# EAGLE schematic SparkFun_Tsunami_Qwiic (EAGLE 9.6.2)

## Sheet 1 of 2
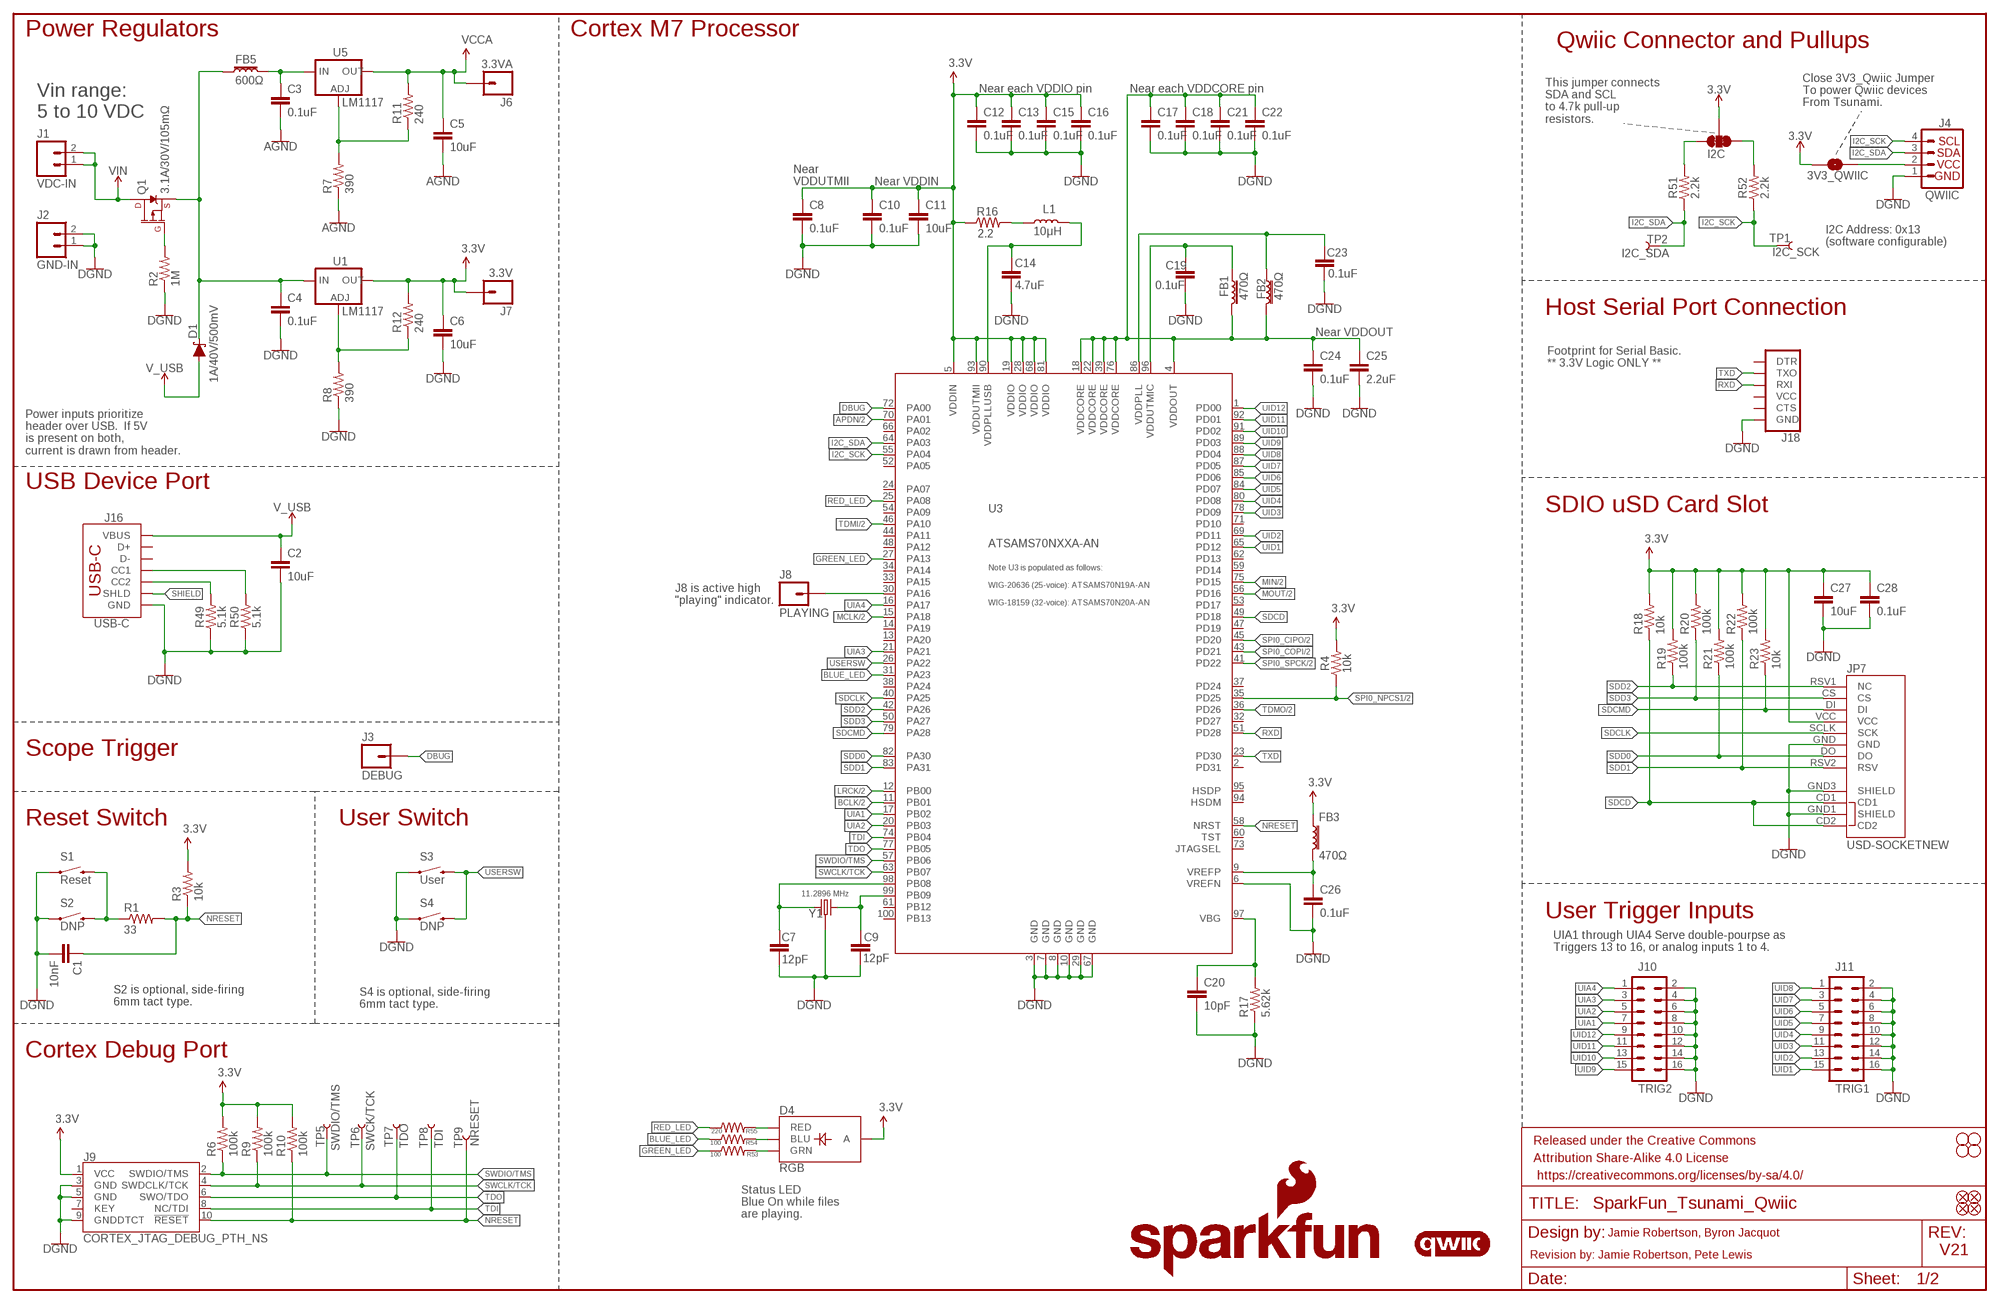
[diagram p0: schematic, sheet 1]

### Parts
3V3_QWIIC  JUMPER-SMT_2_NO_SILK  [SMT-JUMPER_2_NO_SILK]
C1  10nF  10NF-0402T-25V-10%  [0402-TIGHT]
C2  10uF  10UF-0402T-6.3V-20%  [0402-TIGHT]
C3  0.1uF  0.1UF-0402T-16V-10%  [0402-TIGHT]
C4  0.1uF  0.1UF-0402T-16V-10%  [0402-TIGHT]
C5  10uF  10UF-0402T-6.3V-20%  [0402-TIGHT]
C6  10uF  10UF-0402T-6.3V-20%  [0402-TIGHT]
C7  12pF  12PF-0402T-50V-5%  [0402-TIGHT]
C8  0.1uF  0.1UF-0402T-16V-10%  [0402-TIGHT]
C9  12pF  12PF-0402T-50V-5%  [0402-TIGHT]
C10  0.1uF  0.1UF-0402T-16V-10%  [0402-TIGHT]
C11  10uF  10UF-0402T-6.3V-20%  [0402-TIGHT]
C12  0.1uF  0.1UF-0402T-16V-10%  [0402-TIGHT]
C13  0.1uF  0.1UF-0402T-16V-10%  [0402-TIGHT]
C14  4.7uF  4.7UF-0402_TIGHT-6.3V-20%-X5R  [0402-TIGHT]
C15  0.1uF  0.1UF-0402T-16V-10%  [0402-TIGHT]
C16  0.1uF  0.1UF-0402T-16V-10%  [0402-TIGHT]
C17  0.1uF  0.1UF-0402T-16V-10%  [0402-TIGHT]
C18  0.1uF  0.1UF-0402T-16V-10%  [0402-TIGHT]
C19  0.1uF  0.1UF-0402T-16V-10%  [0402-TIGHT]
C20  10pF  10PF-0603-50V-5%  [0603]
C21  0.1uF  0.1UF-0402T-16V-10%  [0402-TIGHT]
C22  0.1uF  0.1UF-0402T-16V-10%  [0402-TIGHT]
C23  0.1uF  0.1UF-0402T-16V-10%  [0402-TIGHT]
C24  0.1uF  0.1UF-0402T-16V-10%  [0402-TIGHT]
C25  2.2uF  2.2UF-0603-10V-20%  [0603]
C26  0.1uF  0.1UF-0402T-16V-10%  [0402-TIGHT]
C27  10uF  10UF-0402T-6.3V-20%  [0402-TIGHT]
C28  0.1uF  0.1UF-0402T-16V-10%  [0402-TIGHT]
D1  1A/40V/500mV  DIODE-SCHOTTKY-SS14  [SMA-DIODE]
D4  RGB  LED-RGB-CAPLCC  [P-LCC-4-3]
FB1  470Ω  FERRITE_BEAD-0603-470Ω-100MHZ-1A-200MILIΩ  [0603]
FB2  470Ω  FERRITE_BEAD-0603-470Ω-100MHZ-1A-200MILIΩ  [0603]
FB3  470Ω  FERRITE_BEAD-0603-470Ω-100MHZ-1A-200MILIΩ  [0603]
FB5  600Ω  FERRITE_BEAD-0805-600Ω-100MHZ  [0805]
FD1  FIDUCIALUFIDUCIAL  [FIDUCIAL-MICRO]
FD2  FIDUCIALUFIDUCIAL  [FIDUCIAL-MICRO]
FD3  FIDUCIALUFIDUCIAL  [FIDUCIAL-MICRO]
FD4  FIDUCIALUFIDUCIAL  [FIDUCIAL-MICRO]
FRAME1  FRAME-LEDGER  [CREATIVE_COMMONS]
H1  STAND-OFF  [STAND-OFF]
H2  STAND-OFF  [STAND-OFF]
H3  STAND-OFF  [STAND-OFF]
H4  STAND-OFF  [STAND-OFF]
I2C  JUMPER-SMT_3_2-NC_TRACE_SILK  [SMT-JUMPER_3_2-NC_TRACE_SILK]
J1  VDC-IN  CONN_021X02_NO_SILK  [1X02_NO_SILK]
J2  GND-IN  CONN_021X02_NO_SILK  [1X02_NO_SILK]
J3  DEBUG  CONN_01PTH_NO_SILK_YES_STOP  [1X01_NO_SILK]
J4  QWIIC  I2C_STANDARDQWIIC  [JST04_1MM_RA]
J6  3.3VA  CONN_01PTH_NO_SILK_YES_STOP  [1X01_NO_SILK]
J7  3.3V  CONN_01PTH_NO_SILK_YES_STOP  [1X01_NO_SILK]
J8  PLAYING  CONN_01PTH_NO_SILK_YES_STOP  [1X01_NO_SILK]
J9  CORTEX_JTAG_DEBUG_PTH_NS  [2X5-PTH-1.27MM-NO_SILK]
J10  TRIG2  CONN_08X2_NOSILK  [2X8_NOSILK]
J11  TRIG1  CONN_08X2_NOSILK  [2X8_NOSILK]
J16  USB-C  USB_C_4-LAYER-ISOLATED  [USB-C-16P-4LAYER-ISOLATED]
J18  6_PIN_SERIAL_TARGETSILK  [6_PIN_SERIAL_TARGET_SIDE_W_SILK]
JP7  USD-SOCKETNEW  [MICRO-SD-SOCKET-PP]
L1  10μH  10μH_SHIELDED_INDUCTOR0805  [0805]
LOGO2  SFE_LOGO_NAME_FLAME.2_INCH  [SFE_LOGO_NAME_FLAME_.2]
LOGO3  QWIIC_LOGO_4MM  [QWIIC_4MM]
Q1  3.1A/30V/105mΩ  MOSFET_PCH-DMG2307L  [SOT23-3]
R1  33  33OHM-0603-1/10W-1%  [0603]
R2  1M  1MOHM-0603-1/4W-5%  [0603]
R3  10k  10KOHM-0402T-1/16W-1%  [0402-TIGHT]
R4  10k  10KOHM-0402T-1/16W-1%  [0402-TIGHT]
R6  100k  100KOHM-0402T-1/16W-1%  [0402-TIGHT]
R7  390  390OHM-0603-1/10W-1%  [0603]
R8  390  390OHM-0603-1/10W-1%  [0603]
R9  100k  100KOHM-0402T-1/16W-1%  [0402-TIGHT]
R10  100k  100KOHM-0402T-1/16W-1%  [0402-TIGHT]
R11  240  240OHM-0603-1/10W-1%  [0603]
R12  240  240OHM-0603-1/10W-1%  [0603]
R16  2.2  2.2OHM-0603-1/10W-5%  [0603]
R17  5.62k  5.62KOHM-0603-1/10W-1%  [0603]
R18  10k  10KOHM-0402T-1/16W-1%  [0402-TIGHT]
R19  100k  100KOHM-0402T-1/16W-1%  [0402-TIGHT]
R20  100k  100KOHM-0402T-1/16W-1%  [0402-TIGHT]
R21  100k  100KOHM-0402T-1/16W-1%  [0402-TIGHT]
R22  100k  100KOHM-0402T-1/16W-1%  [0402-TIGHT]
R23  10k  10KOHM-0402T-1/16W-1%  [0402-TIGHT]
R49  5.1k  5.1KOHM-0402T-1/16W-1%  [0402-TIGHT]
R50  5.1k  5.1KOHM-0402T-1/16W-1%  [0402-TIGHT]
R51  2.2k  2.2KOHM-0402T-1/16W-1%  [0402-TIGHT]
R52  2.2k  2.2KOHM-0402T-1/16W-1%  [0402-TIGHT]
R53  100  100OHM-0603-1/10W-1%  [0603]
R54  100  100OHM-0603-1/10W-1%  [0603]
R55  220  220OHM-0603-1/10W-1%  [0603]
S1  Reset  MOMENTARY-SWITCH-SPST-SMD-5.2MM-TALL  [TACTILE_SWITCH_SMD_5.2MM]
S2  DNP  MOMENTARY-SWITCH-SPST-PTH-RIGHT-ANGLE  [TACTILE_SWITCH_PTH_RIGHT_ANGLE]
S3  User  MOMENTARY-SWITCH-SPST-SMD-5.2MM-TALL  [TACTILE_SWITCH_SMD_5.2MM]
S4  DNP  MOMENTARY-SWITCH-SPST-PTH-RIGHT-ANGLE  [TACTILE_SWITCH_PTH_RIGHT_ANGLE]
TP1  I2C_SCK  TEST-POINTTP_15TH_THRU  [TP_15TH]
TP2  I2C_SDA  TEST-POINTTP_15TH_THRU  [TP_15TH]
TP5  SWDIO/TMS  TEST-POINTTP_15TH_THRU  [TP_15TH]
TP6  SWCK/TCK  TEST-POINTTP_15TH_THRU  [TP_15TH]
TP7  TDO  TEST-POINTTP_15TH_THRU  [TP_15TH]
TP8  TDI  TEST-POINTTP_15TH_THRU  [TP_15TH]
TP9  NRESET  TEST-POINTTP_15TH_THRU  [TP_15TH]
U1  LM1117  V_REG_LM1117SOT223  [SOT223]
U3  ATSAMS70NXXA-AN  [LQFP100]
U5  LM1117  V_REG_LM1117SOT223  [SOT223]
Y1  11.2896 MHz  CRYSTAL-11.2896  [CRYSTAL-OSC-SMD-5X3]

### Nets
3.3V: 3V3_QWIIC.1 C6.1 C8.1 C10.1 C11.1 C12.1 C13.1 C15.1 C16.1 C27.1 C28.1 D4.4(A) FB3.1 I2C.2 J7.1 J9.1(VCC) JP7.VCC R3.2 R4.2 R6.2 R9.2 R10.2 R12.2 R16.1 R18.2 R19.2 R20.2 R21.2 R22.2 R23.2 U1.2(OUT) U1.4(OUT) U3.5(VDDIN) U3.19(VDDIO) U3.28(VDDIO) U3.68(VDDIO) U3.81(VDDIO) U3.93(VDDUTMII) ; also sheet 2
AGND: C3.2 C5.2 R7.1 ; also sheet 2
APDN: U3.70(PA01) ; also sheet 2
BCLK: U3.11(PB01) ; also sheet 2
BLUE_LED: R54.1 U3.31(PA23)
CC1: J16.A5(CC1) R50.2
CC2: J16.B5(CC2) R49.2
DBUG: J3.1 U3.72(PA00)
DGND: C1.2 C2.2 C4.2 C6.2 C7.2 C8.2 C9.2 C10.2 C11.2 C12.2 C13.2 C14.2 C15.2 C16.2 C17.2 C18.2 C19.2 C20.2 C21.2 C22.2 C23.2 C24.2 C25.2 C26.2 C27.2 C28.2 J2.1 J2.2 J4.1 J9.3(GND) J9.5(GND) J9.9(GNDDTCT) J10.2 J10.4 J10.6 J10.8 J10.10 J10.12 J10.14 J10.16 J11.2 J11.4 J11.6 J11.8 J11.10 J11.12 J11.14 J11.16 J16.GND J16.GND2(GND) J18.6(GND) JP7.GND JP7.GND1(SHIELD) JP7.GND3(SHIELD) R2.1 R8.1 R17.1 R49.1 R50.1 S1.1 S2.1 S3.1 S4.1 U3.3(GND) U3.6(VREFN) U3.7(GND) U3.8(GND) U3.10(GND) U3.29(GND) U3.67(GND) Y1.2 Y1.4 ; also sheet 2
GREEN_LED: R53.1 U3.27(PA13)
I2C_SCK: J4.4 R52.1 TP1.1 U3.55(PA04)
I2C_SDA: J4.3 R51.1 TP2.1 U3.64(PA03)
LRCK: U3.12(PB00) ; also sheet 2
MCLK: U3.15(PA18) ; also sheet 2
MIN: U3.75(PD15) ; also sheet 2
MOUT: U3.56(PD16) ; also sheet 2
N$1: C7.1 U3.98(PB08) Y1.1
N$2: C9.1 U3.99(PB09) Y1.3
N$3: C19.1 FB1.1 U3.96(VDDUTMIC)
N$4: C14.1 L1.2 U3.90(VDDPLLUSB)
N$5: C23.1 FB2.1 U3.86(VDDPLL)
N$7: I2C.3 R51.2
N$8: J8.1 U3.30(PA16)
N$9: I2C.1 R52.2
N$16: C20.1 R17.2 U3.97(VBG)
N$17: C26.1 FB3.2 U3.9(VREFP)
N$24: L1.1 R16.2
N$25: R7.2 R11.1 U5.1(ADJ)
N$26: R1.1 S1.3 S2.2
N$29: R8.2 R12.1 U1.1(ADJ)
N$34: 3V3_QWIIC.2 J4.2
N$35: D4.2(GRN) R53.2
N$36: D4.3(BLU) R54.2
N$37: D4.1(RED) R55.2
N$45: C3.1 FB5.2 U5.3(IN)
N$75: Q1.1(G) R2.2
NRESET: C1.1 J9.10(!RESET) R1.2 R3.1 R10.1 TP9.1 U3.58(NRST)
RED_LED: R55.1 U3.25(PA08)
REGINPUTS: C4.1 D1.C FB5.1 Q1.2(S) U1.3(IN)
RXD: J18.3(RXI) U3.51(PD28)
SDCD: JP7.CD1 JP7.CD2 R18.1 U3.49(PD18)
SDCLK: JP7.SCLK(SCK) U3.40(PA25)
SDCMD: JP7.DI R23.1 U3.79(PA28)
SDD0: JP7.DO R21.1 U3.82(PA30)
SDD1: JP7.RSV2(RSV) R22.1 U3.83(PA31)
SDD2: JP7.RSV1(NC) R19.1 U3.42(PA26)
SDD3: JP7.CS R20.1 U3.50(PA27)
SHIELD: J16.SHLD1(SHLD) J16.SHLD2(SHLD) J16.SHLD3(SHLD) J16.SHLD4(SHLD) J16.SHLD5(SHLD) J16.SHLD6(SHLD) J16.SHLD7(SHLD) J16.SHLD8(SHLD)
SPI0_CIPO: U3.45(PD20) ; also sheet 2
SPI0_COPI: U3.43(PD21) ; also sheet 2
SPI0_NPCS1: R4.1 U3.35(PD25) ; also sheet 2
SPI0_SPCK: U3.41(PD22) ; also sheet 2
SWCLK/TCK: J9.4(SWDCLK/TCK) R9.1 TP6.1 U3.63(PB07)
SWDIO/TMS: J9.2(SWDIO/TMS) R6.1 TP5.1 U3.57(PB06)
TDI: J9.8(NC/TDI) TP8.1 U3.74(PB04)
TDMI: U3.46(PA10) ; also sheet 2
TDMO: U3.36(PD26) ; also sheet 2
TDO: J9.6(SWO/TDO) TP7.1 U3.77(PB05)
TXD: J18.2(TXO) U3.23(PD30)
UIA1: J10.7 U3.17(PB02)
UIA2: J10.5 U3.20(PB03)
UIA3: J10.3 U3.21(PA21)
UIA4: J10.1 U3.16(PA17)
UID1: J11.15 U3.65(PD12)
UID2: J11.13 U3.69(PD11)
UID3: J11.11 U3.78(PD09)
UID4: J11.9 U3.80(PD08)
UID5: J11.7 U3.84(PD07)
UID6: J11.5 U3.85(PD06)
UID7: J11.3 U3.87(PD05)
UID8: J11.1 U3.88(PD04)
UID9: J10.15 U3.89(PD03)
UID10: J10.13 U3.91(PD02)
UID11: J10.11 U3.92(PD01)
UID12: J10.9 U3.1(PD00)
USERSW: S3.3 S4.2 U3.26(PA22)
V_USB: C2.1 D1.A J16.VBUS1(VBUS) J16.VBUS2(VBUS)
VCCA: C5.1 J6.1 R11.2 U5.2(OUT) U5.4(OUT) ; also sheet 2
VDDOUT: C17.1 C18.1 C21.1 C22.1 C24.1 C25.1 FB1.2 FB2.2 U3.4(VDDOUT) U3.18(VDDCORE) U3.22(VDDCORE) U3.39(VDDCORE) U3.76(VDDCORE)
VIN: J1.1 J1.2 Q1.3(D)
Unconnected: J9.7(KEY) J16.A6(D+) J16.A7(D-) J16.B6(D+) J16.B7(D-) J18.1(DTR) J18.4(VCC) J18.5(CTS) U3.2(PD31) U3.13(PA20) U3.14(PA19) U3.24(PA07) U3.32(PD27) U3.33(PA15) U3.34(PA14) U3.37(PD24) U3.38(PA24) U3.44(PA11) U3.47(PD19) U3.48(PA12) U3.52(PA05) U3.53(PD17) U3.54(PA09) U3.59(PD14) U3.60(TST) U3.61(PB12) U3.62(PD13) U3.66(PA02) U3.71(PD10) U3.73(JTAGSEL) U3.94(HSDM) U3.95(HSDP) U3.100(PB13)

### Notes on the sheet
- Power Regulators | Cortex M7 Processor
- Qwiic Connector and Pullups
- Near each VDDIO pin | Near each VDDCORE pin
- This jumper connects 
  SDA and SCL 
  to 4.7k pull-up 
  resistors.
- Close 3V3_Qwiic Jumper
  To power Qwiic devices
  From Tsunami.
- Vin range:
  5 to 10 VDC
- Near
  VDDUTMII
- Near VDDIN
- I2C Address: 0x13
  (software configurable)
- Host Serial Port Connection
- Near VDDOUT
- Footprint for Serial Basic.
  ** 3.3V Logic ONLY **
- Power inputs prioritize 
  header over USB.  If 5V 
  is present on both, 
  current is drawn from header.
- USB Device Port
- SDIO uSD Card Slot
- J8 is active high
  "playing" indicator.
- Note U3 is populated as follows:
  
  WIG-20636 (25-voice): ATSAMS70N19A-AN 
  
  WIG-18159 (32-voice): ATSAMS70N20A-AN
- Scope Trigger
- Reset Switch | User Switch
- User Trigger Inputs
- UIA1 through UIA4 Serve double-pourpse as
  Triggers 13 to 16, or analog inputs 1 to 4.
- S2 is optional, side-firing 
  6mm tact type.
- S4 is optional, side-firing 
  6mm tact type.
- Cortex Debug Port
- Status LED
  Blue On while files 
  are playing.
- Jamie Robertson, Byron Jacquot
- V21
- Revision by: Jamie Robertson, Pete Lewis

## Sheet 2 of 2
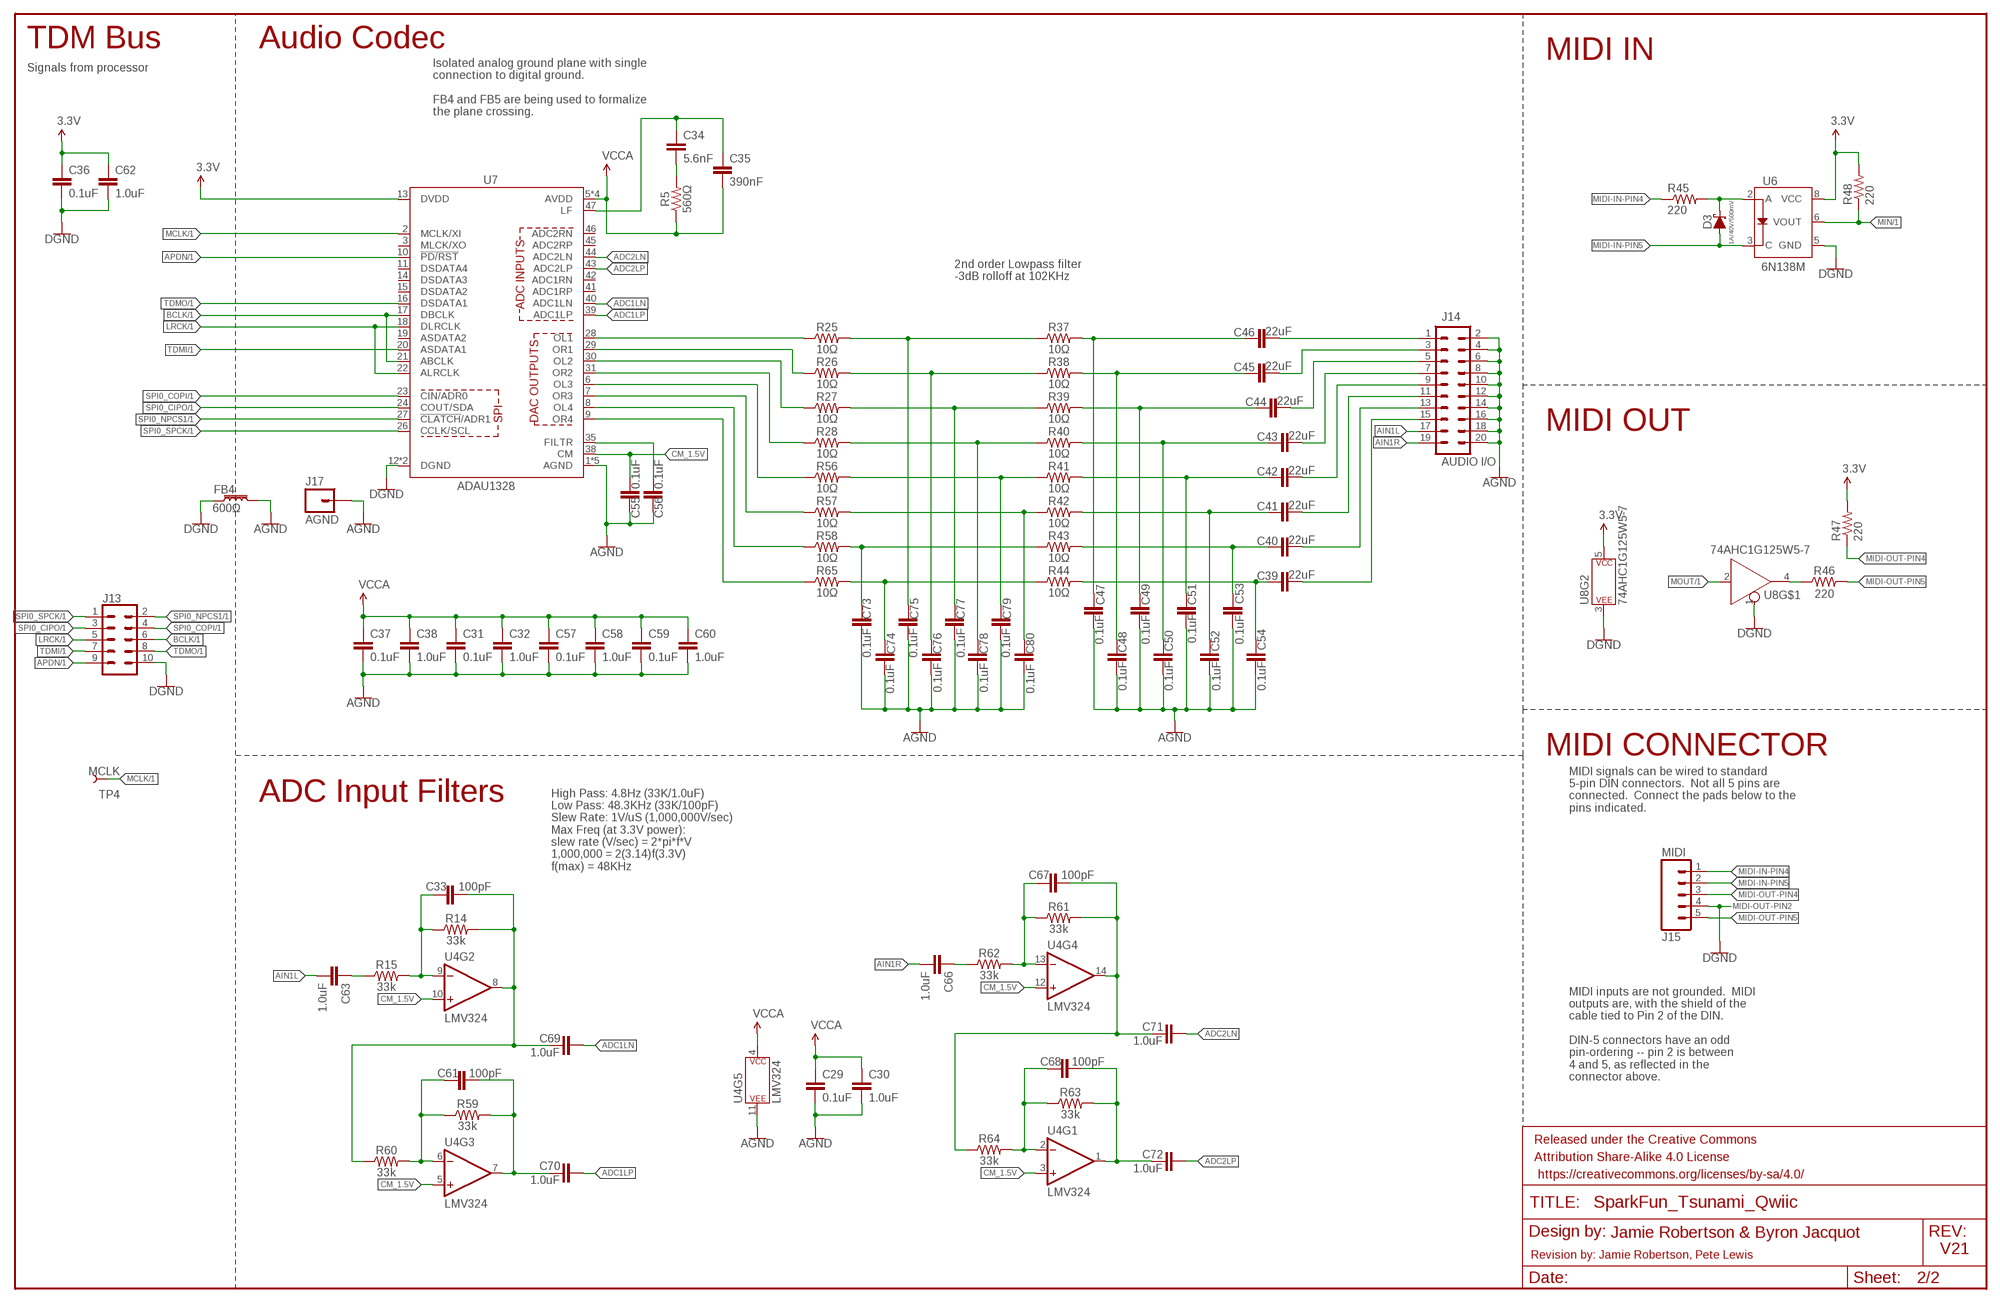
[diagram p1: schematic, sheet 2]

### Parts
C29  0.1uF  0.1UF-0402T-16V-10%  [0402-TIGHT]
C30  1.0uF  1.0UF-0402T-16V-10%  [0402-TIGHT]
C31  0.1uF  0.1UF-0402T-16V-10%  [0402-TIGHT]
C32  1.0uF  1.0UF-0402T-16V-10%  [0402-TIGHT]
C33  100pF  100PF-0402T-50V-5%  [0402-TIGHT]
C34  5.6nF  5.6NF/5600PF_0603_50V_5%  [0603]
C35  390nF  390NF-0603-10V-10%  [0603]
C36  0.1uF  0.1UF-0402T-16V-10%  [0402-TIGHT]
C37  0.1uF  0.1UF-0402T-16V-10%  [0402-TIGHT]
C38  1.0uF  1.0UF-0402T-16V-10%  [0402-TIGHT]
C39  22uF  22UF-0805-16V-20%  [0805]
C40  22uF  22UF-0805-16V-20%  [0805]
C41  22uF  22UF-0805-16V-20%  [0805]
C42  22uF  22UF-0805-16V-20%  [0805]
C43  22uF  22UF-0805-16V-20%  [0805]
C44  22uF  22UF-0805-16V-20%  [0805]
C45  22uF  22UF-0805-16V-20%  [0805]
C46  22uF  22UF-0805-16V-20%  [0805]
C47  0.1uF  0.1UF-0402T-16V-10%  [0402-TIGHT]
C48  0.1uF  0.1UF-0402T-16V-10%  [0402-TIGHT]
C49  0.1uF  0.1UF-0402T-16V-10%  [0402-TIGHT]
C50  0.1uF  0.1UF-0402T-16V-10%  [0402-TIGHT]
C51  0.1uF  0.1UF-0402T-16V-10%  [0402-TIGHT]
C52  0.1uF  0.1UF-0402T-16V-10%  [0402-TIGHT]
C53  0.1uF  0.1UF-0402T-16V-10%  [0402-TIGHT]
C54  0.1uF  0.1UF-0402T-16V-10%  [0402-TIGHT]
C55  0.1uF  0.1UF-0402T-16V-10%  [0402-TIGHT]
C56  0.1uF  0.1UF-0402T-16V-10%  [0402-TIGHT]
C57  0.1uF  0.1UF-0402T-16V-10%  [0402-TIGHT]
C58  1.0uF  1.0UF-0402T-16V-10%  [0402-TIGHT]
C59  0.1uF  0.1UF-0402T-16V-10%  [0402-TIGHT]
C60  1.0uF  1.0UF-0402T-16V-10%  [0402-TIGHT]
C61  100pF  100PF-0402T-50V-5%  [0402-TIGHT]
C62  1.0uF  1.0UF-0402T-16V-10%  [0402-TIGHT]
C63  1.0uF  1.0UF-0402T-16V-10%  [0402-TIGHT]
C66  1.0uF  1.0UF-0402T-16V-10%  [0402-TIGHT]
C67  100pF  100PF-0402T-50V-5%  [0402-TIGHT]
C68  100pF  100PF-0402T-50V-5%  [0402-TIGHT]
C69  1.0uF  1.0UF-0402T-16V-10%  [0402-TIGHT]
C70  1.0uF  1.0UF-0402T-16V-10%  [0402-TIGHT]
C71  1.0uF  1.0UF-0402T-16V-10%  [0402-TIGHT]
C72  1.0uF  1.0UF-0402T-16V-10%  [0402-TIGHT]
C73  0.1uF  0.1UF-0402T-16V-10%  [0402-TIGHT]
C74  0.1uF  0.1UF-0402T-16V-10%  [0402-TIGHT]
C75  0.1uF  0.1UF-0402T-16V-10%  [0402-TIGHT]
C76  0.1uF  0.1UF-0402T-16V-10%  [0402-TIGHT]
C77  0.1uF  0.1UF-0402T-16V-10%  [0402-TIGHT]
C78  0.1uF  0.1UF-0402T-16V-10%  [0402-TIGHT]
C79  0.1uF  0.1UF-0402T-16V-10%  [0402-TIGHT]
C80  0.1uF  0.1UF-0402T-16V-10%  [0402-TIGHT]
D3  1A/40V/500mV  DIODE-SCHOTTKY-SS14  [SMA-DIODE]
FB4  600Ω  FERRITE_BEAD-0805-600Ω-100MHZ  [0805]
FRAME2  FRAME-LEDGER  [CREATIVE_COMMONS]
J13  CONN_05X2NO_SILK  [2X5_NOSILK]
J14  AUDIO I/O  CONN_10X2NOSILK  [2X10_NOSILK]
J15  MIDI  CONN_05NO_SILK  [1X05_NO_SILK]
J17  AGND  CONN_01PTH_NO_SILK_YES_STOP  [1X01_NO_SILK]
R5  560Ω  560OHM_0402_TIGHT  [0402-TIGHT]
R14  33k  33KOHM-0402T-1/16W-1%  [0402-TIGHT]
R15  33k  33KOHM-0402T-1/16W-1%  [0402-TIGHT]
R25  10Ω  10OHM-0402-1/16W-5%  [0402-TIGHT]
R26  10Ω  10OHM-0402-1/16W-5%  [0402-TIGHT]
R27  10Ω  10OHM-0402-1/16W-5%  [0402-TIGHT]
R28  10Ω  10OHM-0402-1/16W-5%  [0402-TIGHT]
R37  10Ω  10OHM-0402-1/16W-5%  [0402-TIGHT]
R38  10Ω  10OHM-0402-1/16W-5%  [0402-TIGHT]
R39  10Ω  10OHM-0402-1/16W-5%  [0402-TIGHT]
R40  10Ω  10OHM-0402-1/16W-5%  [0402-TIGHT]
R41  10Ω  10OHM-0402-1/16W-5%  [0402-TIGHT]
R42  10Ω  10OHM-0402-1/16W-5%  [0402-TIGHT]
R43  10Ω  10OHM-0402-1/16W-5%  [0402-TIGHT]
R44  10Ω  10OHM-0402-1/16W-5%  [0402-TIGHT]
R45  220  220OHM-0603-1/10W-1%  [0603]
R46  220  220OHM-0603-1/10W-1%  [0603]
R47  220  220OHM-0603-1/10W-1%  [0603]
R48  220  220OHM-0603-1/10W-1%  [0603]
R56  10Ω  10OHM-0402-1/16W-5%  [0402-TIGHT]
R57  10Ω  10OHM-0402-1/16W-5%  [0402-TIGHT]
R58  10Ω  10OHM-0402-1/16W-5%  [0402-TIGHT]
R59  33k  33KOHM-0402T-1/16W-1%  [0402-TIGHT]
R60  33k  33KOHM-0402T-1/16W-1%  [0402-TIGHT]
R61  33k  33KOHM-0402T-1/16W-1%  [0402-TIGHT]
R62  33k  33KOHM-0402T-1/16W-1%  [0402-TIGHT]
R63  33k  33KOHM-0402T-1/16W-1%  [0402-TIGHT]
R64  33k  33KOHM-0402T-1/16W-1%  [0402-TIGHT]
R65  10Ω  10OHM-0402-1/16W-5%  [0402-TIGHT]
TP4  MCLK  TEST-POINTTP_15TH_THRU  [TP_15TH]
U4  LMV324  [SO14]
U6  6N138M  OPTO_DARL_6N138S  [8-SMD]
U7  ADAU1328  [LQFP-48]
U8  74AHC1G125W5-7  741G12574AHC1G125W5-7  [SOT23-5]

### Nets
3.3V: C36.1 C62.1 R47.2 R48.2 U6.8(VCC) U7.13(DVDD) U8.5(P$V+) ; also sheet 1
56: D3.C R45.2 U6.2(A)
ADC1LN: C69.1 U7.40(ADC1LN)
ADC1LP: C70.1 U7.39(ADC1LP)
ADC2LN: C71.1 U7.44(ADC2LN)
ADC2LP: C72.1 U7.43(ADC2LP)
AGND: C29.2 C30.2 C31.2 C32.2 C37.2 C38.2 C47.2 C48.2 C49.2 C50.2 C51.2 C52.2 C53.2 C54.2 C55.2 C56.2 C57.2 C58.2 C59.2 C60.2 C73.1 C74.1 C75.1 C76.1 C77.1 C78.1 C79.1 C80.1 FB4.2 J14.2 J14.4 J14.6 J14.8 J14.10 J14.12 J14.14 J14.16 J14.18 J14.20 J17.1 U4.11(P$V-) U7.1(AGND) U7.4(AGND) U7.32(AGND) U7.34(AGND) U7.36(AGND) ; also sheet 1
AIN1L: C63.2 J14.17
AIN1R: C66.2 J14.19
AOUT1L: C46.1 C47.1 R37.2
AOUT1R: C45.1 C48.1 R38.2
AOUT2L: C44.2 J14.5
AOUT2R: C43.1 C50.1 R40.2
AOUT3L: C42.2 J14.9
AOUT3R: C41.1 C52.1 R42.2
AOUT4L: C40.1 C53.1 R43.2
AOUT4R: C39.1 C54.1 R44.2
APDN: J13.9 U7.10(!PD/RST!) ; also sheet 1
BCLK: J13.6 U7.17(DBCLK) U7.21(ABCLK) ; also sheet 1
CM_1.5V: C55.1 U4.3(+IN) U4.5(+IN) U4.10(+IN) U4.12(+IN) U7.38(CM)
DGND: C36.2 C62.2 FB4.1 J13.10 J15.4 U6.5(GND) U7.12(DGND) U7.25(DGND) U8.1(!EN) U8.3(P$V-) ; also sheet 1
LF: C34.1 C35.1 U7.47(LF)
LRCK: J13.5 U7.18(DLRCLK) U7.22(ALRCLK) ; also sheet 1
MCLK: TP4.1 U7.2(MCLK/XI) ; also sheet 1
MIDI-IN-PIN4: J15.1 R45.1
MIDI-IN-PIN5: D3.A J15.2 U6.3(C)
MIDI-OUT-PIN4: J15.3 R47.1
MIDI-OUT-PIN5: J15.5 R46.2
MIN: R48.1 U6.6(VOUT) ; also sheet 1
MOUT: U8.2(A) ; also sheet 1
N$6: C33.2 C69.2 R14.2 R60.1 U4.8(OUT)
N$11: C34.2 R5.2
N$12: C63.1 R15.1
N$14: C61.2 C70.2 R59.2 U4.7(OUT)
N$15: C68.2 C72.2 R63.2 U4.1(OUT)
N$18: C39.2 J14.15
N$19: C40.2 J14.13
N$20: C41.2 J14.11
N$21: C42.1 C51.1 R41.2
N$22: C43.2 J14.7
N$23: C75.2 R25.2 R37.1
N$27: C74.2 R44.1 R65.2
N$28: C73.2 R43.1 R58.2
N$30: C80.2 R42.1 R57.2
N$31: C44.1 C49.1 R39.2
N$32: C46.2 J14.1
N$33: C45.2 J14.3
N$38: R46.1 U8.4(Y)
N$48: C56.1 U7.35(FILTR)
N$49: C61.1 R59.1 R60.2 U4.6(-IN)
N$51: C33.1 R14.1 R15.2 U4.9(-IN)
N$52: C79.2 R41.1 R56.2
N$53: C78.2 R28.2 R40.1
N$54: C76.2 R26.2 R38.1
N$55: C77.2 R27.2 R39.1
N$56: C67.2 C71.2 R61.2 R64.1 U4.14(OUT)
N$58: C66.1 R62.1
N$59: C68.1 R63.1 R64.2 U4.2(-IN)
N$60: C67.1 R61.1 R62.2 U4.13(-IN)
OL1: R25.1 U7.28(OL1)
OL2: R27.1 U7.30(OL2)
OL3: R56.1 U7.6(OL3)
OL4: R58.1 U7.8(OL4)
OR1: R26.1 U7.29(OR1)
OR2: R28.1 U7.31(OR2)
OR3: R57.1 U7.7(OR3)
OR4: R65.1 U7.9(OR4)
SPI0_CIPO: J13.3 U7.24(COUT/SDA) ; also sheet 1
SPI0_COPI: J13.4 U7.23(CIN/ADR0) ; also sheet 1
SPI0_NPCS1: J13.2 U7.27(!CLATCH!/ADR1) ; also sheet 1
SPI0_SPCK: J13.1 U7.26(CCLK/SCL) ; also sheet 1
TDMI: J13.7 U7.20(ASDATA1) ; also sheet 1
TDMO: J13.8 U7.16(DSDATA1) ; also sheet 1
VCCA: C29.1 C30.1 C31.1 C32.1 C35.2 C37.1 C38.1 C57.1 C58.1 C59.1 C60.1 R5.1 U4.4(P$V+) U7.5(AVDD) U7.33(AVDD) U7.37(AVDD) U7.48(AVDD) ; also sheet 1
Unconnected: U7.3(MLCK/XO) U7.11(DSDATA4) U7.14(DSDATA3) U7.15(DSDATA2) U7.19(ASDATA2) U7.41(ADC1RP) U7.42(ADC1RN) U7.45(ADC2RP) U7.46(ADC2RN)

### Notes on the sheet
- TDM Bus | Audio Codec
- MIDI IN
- Signals from processor
- Isolated analog ground plane with single
  connection to digital ground.
  
  FB4 and FB5 are being used to formalize 
  the plane crossing.
- 2nd order Lowpass filter
  -3dB rolloff at 102KHz
- MIDI OUT
- MIDI CONNECTOR
- MIDI signals can be wired to standard 
  5-pin DIN connectors.  Not all 5 pins are 
  connected.  Connect the pads below to the 
  pins indicated.
- ADC Input Filters
- High Pass: 4.8Hz (33K/1.0uF)
  Low Pass: 48.3KHz (33K/100pF)
  Slew Rate: 1V/uS (1,000,000V/sec)
  Max Freq (at 3.3V power): 
  slew rate (V/sec) = 2*pi*f*V
  1,000,000 = 2(3.14)f(3.3V)
  f(max) = 48KHz
- MIDI-OUT-PIN2
- MIDI inputs are not grounded.  MIDI 
  outputs are, with the shield of the 
  cable tied to Pin 2 of the DIN.
  
  DIN-5 connectors have an odd 
  pin-ordering -- pin 2 is between 
  4 and 5, as reflected in the 
  connector above.
- Jamie Robertson & Byron Jacquot
- V21
- Revision by: Jamie Robertson, Pete Lewis

## Library data of the parts
3V3_QWIIC = SparkFun-Jumpers:JUMPER-SMT_2_NO: Normally open jumper This jumper has two pads in close proximity to each other. Apply solder to close the connection. Round pads are easier to solder for beginners, but are a lot larger. SparkFun Product that uses the round pads: SparkFun EL Sequencer
C1 = SparkFun-Capacitors:10NF: 0.01uF/10nF/10,000pF ceramic capacitors A capacitor is a passive two-terminal electrical component used to store electrical energy temporarily in an electric field. CAP-09321; PROD_ID: CAP-14847
C2 C5 C6 C11 C27 = SparkFun-Capacitors:10UF: 10.0µF ceramic capacitors A capacitor is a passive two-terminal electrical component used to store electrical energy temporarily in an electric field.; PROD_ID: CAP-14848
C3 C4 C8 C10 C12 C13 C15-C19 C21-C24 C26 C28 C29 C31 C36 C37 C47-C57 C59 C73-C80 = SparkFun-Capacitors:0.1UF: 0.1µF ceramic capacitors A capacitor is a passive two-terminal electrical component used to store electrical energy temporarily in an electric field.; PROD_ID: CAP-12416
C7 C9 = SparkFun-Capacitors:12PF: 12pF ceramic capacitors A capacitor is a passive two-terminal electrical component used to store electrical energy temporarily in an electric field.; PROD_ID: CAP-14665
C14 = SparkFun-Capacitors:4.7UF: 4.7µF ceramic capacitors A capacitor is a passive two-terminal electrical component used to store electrical energy temporarily in an electric field.; PROD_ID: CAP-14240
C20 = SparkFun-Capacitors:10PF: 10pF ceramic capacitors A capacitor is a passive two-terminal electrical component used to store electrical energy temporarily in an electric field.; PROD_ID: CAP-11812
C25 = SparkFun-Capacitors:2.2UF: 2.2µF ceramic capacitors A capacitor is a passive two-terminal electrical component used to store electrical energy temporarily in an electric field.; PROD_ID: CAP-07888
C30 C32 C38 C58 C60 C62 C63 C66 C69-C72 = SparkFun-Capacitors:1.0UF: 1µF ceramic capacitors A capacitor is a passive two-terminal electrical component used to store electrical energy temporarily in an electric field.; PROD_ID: CAP-12417
C33 C61 C67 C68 = SparkFun-Capacitors:100PF: 100pF/0.1nF ceramic capacitors A capacitor is a passive two-terminal electrical component used to store electrical energy temporarily in an electric field.; PROD_ID: CAP-13458
C34 = SparkFun-Capacitors:5.6NF/5600PF: 5.6nF/5600pF ceramic capacitors A capacitor is a passive two-terminal electrical component used to store electrical energy temporarily in an electric field.; PROD_ID: CAP-16058
C35 = SparkFun-Capacitors:390NF: 0.39uF/390nF ceramic capacitors A capacitor is a passive two-terminal electrical component used to store electrical energy temporarily in an electric field.; PROD_ID: CAP-10986
C39-C46 = SparkFun-Capacitors:22UF: 22µF ceramic capacitors A capacitor is a passive two-terminal electrical component used to store electrical energy temporarily in an electric field.; PROD_ID: CAP-14260
D1 D3 = SparkFun-DiscreteSemi:DIODE-SCHOTTKY: Schottky diode A Schottky diode is a semiconductor diode which has a low forward voltage drop and a very fast switching action.; PROD_ID: DIO-08053
D4 = SparkFun-LED:LED-RGB-CA: LED-RGB Diffused Common Anode Packages: LED RGB-THRU P-LCC-4-3 LED-TRICOLOR-SMD SparkFun Products: RGB Diffused Common Anode- Diffuse <[https://www.sparkfun.com/products/10821]> RGB Diffused Common Anode - Clear <[https://www.sparkfun.com/products/10820]> Qduino Mini <[https://www.sparkfun.com/products/13614]> Triple Output LED RGB - SMD <https://www.sparkfun.com/products/7844>; PROD_ID: DIO-12986
FB1-FB3 = SparkFun-Coils:FERRITE_BEAD: Ferrite Bead (blocks, cores, rings, chokes, etc.) Inductor with layers of ferrite used to suppress high frequencies. Often used to isolate high frequency noise. SparkFun Products: IOIO-OTG - V2.2 SparkFun SAMD21 Mini Breakout SparkFun 6 Degrees of Freedom Breakout - LSM6DS3 SparkFun SAMD21 Dev Breakout; PROD_ID: NDUC-12579
FB4 FB5 = SparkFun-Coils:FERRITE_BEAD: Ferrite Bead (blocks, cores, rings, chokes, etc.) Inductor with layers of ferrite used to suppress high frequencies. Often used to isolate high frequency noise. SparkFun Products: IOIO-OTG - V2.2 SparkFun SAMD21 Mini Breakout SparkFun 6 Degrees of Freedom Breakout - LSM6DS3 SparkFun SAMD21 Dev Breakout; PROD_ID: NDUC-14988
FD1-FD4 = SparkFun-Aesthetics:FIDUCIAL: Fiducial Alignment Points Point-of-reference for pick-and-place machines and other optical instruments.
FRAME1 FRAME2 = SparkFun-Aesthetics:FRAME-LEDGER: Schematic Frame - Ledger Standard 11x14 US Ledger frame
H1-H4 = SparkFun-Hardware:STAND-OFF: Stand Off Drill holes for mechanically mounting via screws, standoffs, etc. Note: Use the keepout ring to avoid running the screw head into surrounding components. Variant Overviews STAND-OFF - Mechanical footprint for a #4 phillips button head screw. STAND-OFF-TIGHT - Mechanical footprint for a #4 phillips button head screw, Example SparkFun Products Screw - Phillips Head (1/4", 4-40, 10 pack) (PRT-10453) Screw - Phillips Head (1/2", 4-40, 10 pack) (PRT-10452) Screw - Phillips Head (3/4", 4-40, 10 pack) (PRT-10451) Screw - Phillips Head (1", 4-40, 10 pack) (PRT-10450)
I2C = SparkFun-Jumpers:JUMPER-SMT_3_2-NC_TRACE: Normally closed trace jumper (2 of 2 connections) This jumper has a trace between all three pads so they are normally closed (NC). Use a razor knife to open the connection(s). For best results follow the IPC guidelines for cutting traces: Cutout at least 0.063 mm (0.005 in). Remove all loose material to clean up the cut area. Seal the cut with an approved epoxy. Reapply solder to reclose the connection(s).
J1 J2 = SparkFun-Connectors:CONN_02: Multi connection point. Often used as Generic Header-pin footprint for 0.1 inch spaced/style header connections On any of the 0.1 inch spaced packages, you can populate with these: Break Away Headers - Straight (PRT-00116) Break Away Male Headers - Right Angle (PRT-00553) Female Headers (PRT-00115) Break Away Headers - Machine Pin (PRT-00117) Break Away Female Headers - Swiss Machine Pin (PRT-00743) For SCREWTERMINALS and SPRING TERMINALS visit here: Screw Terimnals on SparkFun.com (5mm/3.5mm/2.54mm spacing) This device is also useful as a general connection point to wire up your design to another part of your project. Our various solder wires solder well into these plated through hole pads. Hook-Up Wire - Assortment (Stranded, 22 AWG) (PRT-11375) Hook-Up Wire - Assortment (Solid Core, 22 AWG) (PRT-11367) View the entire wire category on our website here Special notes: Molex polarized connector foot print use with: PRT-08233 with associated crimp pins and housings. 2.54_SCREWTERM for use with PRT-10571. 3.5mm Screw Terminal footprints for PRT-08084 5mm Screw Terminal footprints for use with PRT-08432
J3 J6-J8 J17 = SparkFun-Connectors:CONN_01: Single connection point. Often used as Generic Header-pin footprint for 0.1 inch spaced/style header connections On any of the 0.1 inch spaced packages, you can populate with these: Break Away Headers - Straight (PRT-00116) Break Away Male Headers - Right Angle (PRT-00553) Female Headers (PRT-00115) Break Away Headers - Machine Pin (PRT-00117) Break Away Female Headers - Swiss Machine Pin (PRT-00743) This device is also useful as a general connection point to wire up your design to another part of your project. Our various solder wires solder well into these plated through hole pads. Hook-Up Wire - Assortment (Stranded, 22 AWG) (PRT-11375) Hook-Up Wire - Assortment (Solid Core, 22 AWG) (PRT-11367) View the entire wire category on our website here Special notes: SMTSO-256-ET is a "flush mount" nut for a 4-40 screw. We mostly use this on specialty testbeds; it is a nice way to connect hardware to your PCB at an adjustable hieght. Also note, the SNAP packages are for using a snappable style connector. We sell a baggie of snaps and they are also used on two LilyPad designs: Snap Assortment - 30 pack (male and female) (DEV-11347) LilyPad Arduino SimpleSnap (DEV-10941) LilyPad SimpleSnap Protoboard (DEV-10940)
J4 = SparkFun-Connectors:I2C_STANDARD: SparkFun I2C Standard Pinout Header SparkFun has standardized on a pinout for all I2C based sensor breakouts. This pinout allows I2C boards to be plugged directly into the headers on Arduino Uno compatible boards, and to be daisy chained easily. Example SparkFun Products: SparkFun Atmospheric Sensor Breakout - BME280 <https://www.sparkfun.com/products/13676> SparkFun Altitude/Pressure Sensor Breakout - MPL3115A2 <https://www.sparkfun.com/products/11084> SparkFun TOF Range Finder Sensor - VL6180 <https://www.sparkfun.com/products/12785>; PROD_ID: CONN-13694; VALUE: Qwiic Right Angle
J9 = SparkFun-Connectors:CORTEX_JTAG_DEBUG: Cortex Debug Connector - 10 pin Supports JTAG debug, Serial Wire debug, and Serial Wire Viewer. PTH and SMD connector options available. General Connector Information <http://infocenter.arm.com/help/topic/com.arm.doc.faqs/attached/13634/cortex_debug_connectors.pdf> Products: PTH Connector <http://www.digikey.com/product-detail/en/cnc-tech/3220-10-0100-00/1175-1627-ND/3883661> -via Digi-Key SparkFun PSoc <https://www.sparkfun.com/products/13229> SparkFun T <https://www.sparkfun.com/products/13810>
J10 J11 = SparkFun-Connectors:CONN_08X2: Multi connection point. Often used as Generic Header-pin footprint for 0.1 inch spaced/style header connections You can populate with any combo of single row headers, but if you'd like an exact match, check this: Header - 2x8 (Male, 0.1") (PRT-13156) On any of the 0.1 inch spaced packages, you can populate with these: Break Away Headers - Straight (PRT-00116) Break Away Male Headers - Right Angle (PRT-00553) Female Headers (PRT-00115) Break Away Headers - Machine Pin (PRT-00117) Break Away Female Headers - Swiss Machine Pin (PRT-00743)
J13 = SparkFun-Connectors:CONN_05X2: Multi connection point. Often used as Generic Header-pin footprint for 0.1 inch spaced/style header connections For AVR SPI programming port, see special device with nice symbol: "AVR_SPI_PROG_5x2.dev" You can populate with any combo of single row headers, but if you'd like an exact match, check these: 2x5 AVR ICSP Male Header (PRT-00778) 2x5 Pin Shrouded Header (PRT-08506) On any of the 0.1 inch spaced packages, you can populate with these: Break Away Headers - Straight (PRT-00116) Break Away Male Headers - Right Angle (PRT-00553) Female Headers (PRT-00115) Break Away Headers - Machine Pin (PRT-00117) Break Away Female Headers - Swiss Machine Pin (PRT-00743) Special note: the shrouded connector mates well with our 5x2 ribbon cables: 2x5 Pin IDC Ribbon Cable (PRT-08535)
J14 = SparkFun-Connectors:CONN_10X2: Multi connection point. Often used as Generic Header-pin footprint for 0.1 inch spaced/style header connections On any of the 0.1 inch spaced packages, you can populate with these: Break Away Headers - Straight (PRT-00116) Break Away Male Headers - Right Angle (PRT-00553) Female Headers (PRT-00115) Break Away Headers - Machine Pin (PRT-00117) Break Away Female Headers - Swiss Machine Pin (PRT-00743) Special note about the "SPECIAL" package: This was SPECIALLY designed to be used with our Graphic LCD Backpack. Be sure you want to use this! It is not only staggered on each line of header holes, but IT IS ALSO offset of the center point of the top and bottom lines by 5 mil. This causes the headers to lock into place on the "standard" footprint on the LCD screen. The extra squares on the tdocu layer are there simply to reference other pins (if you were to actually populate a longer header than ten long - this is what we do with the backpacks).
J15 = SparkFun-Connectors:CONN_05: Multi connection point. Often used as Generic Header-pin footprint for 0.1 inch spaced/style header connections On any of the 0.1 inch spaced packages, you can populate with these: Break Away Headers - Straight (PRT-00116) Break Away Male Headers - Right Angle (PRT-00553) Female Headers (PRT-00115) Break Away Headers - Machine Pin (PRT-00117) Break Away Female Headers - Swiss Machine Pin (PRT-00743) For SCREWTERMINALS and SPRING TERMINALS visit here: Screw Terimnals on SparkFun.com (5mm/3.5mm/2.54mm spacing) This device is also useful as a general connection point to wire up your design to another part of your project. Our various solder wires solder well into these plated through hole pads. Hook-Up Wire - Assortment (Stranded, 22 AWG) (PRT-11375) Hook-Up Wire - Assortment (Solid Core, 22 AWG) (PRT-11367) View the entire wire category on our website here Special notes: Molex polarized connector foot print use with SKU : PRT-08231 with associated crimp pins and housings. 1MM SMD Version SKU: PRT-10208
J16 = SparkFun-Connectors:USB_C: USB Type C 16Pin Connector Super Speed pins not available on the 16-pin purely SMD connector so this part is best for USB 2.0 implementations. D1 and D2 are tied together enabling D+/- no matter which way the cable is plugged into the connector. The two channel configuration pins (CC1/2) are exposed. These are normally connected to ground via 5.1k resistors but can be reconfigured for high current/high power applications. **4-LAYER BOARD WARNING!!** If designing 4-layer board, make sure to select the variant _4-LAYER-ISOLATED. The linked footprint (USB-C-16-4LAYER-ISOLATED) includes some very necessary cutout polygons in the inner layers (2 and 15). This prevents the PTH mounting shield legs on the USB connector from electrically connecting any other polygons on the inner layers (usually VCC and GND).; PROD_ID: CONN-14122; VALUE: USB Female Type C Connector
J18 = SparkFun-Connectors:6_PIN_SERIAL_TARGET: 6-pin header connection for use with the "FTDI BASIC" pinout - TARGET SIDE. Also known as "Arduino Serial Program Header". It is used to mate with our FTDI Basic serial programmers using the Arduino IDE. Note, this device has "TARGET" in the name. It is intended to be used on a design that contains a target micro-controller that you wish to program. The "sister" device, named "CABLE" is inteneded to be used on a design that usually lives on the end of your USB cable and prvides the converter chip (FTDI232 or FTDI231x) to commnicate serial RX/TX. You can populate with some of these: Break Away Headers - Straight (PRT-00116) For reference (or to suit your programming needs) check out these designs: SparkFun FTDI Basic Breakout - 5V (DEV-09716) SparkFun FTDI Basic Breakout - 3.3V (DEV-09873) SparkFun FTDI SmartBasic (DEV-12935) SparkFun Beefy 3 - FTDI Basic Breakout (DEV-13746)
JP7 = SparkFun-Retired:USD-SOCKET: microSD Socket Push-push type uSD socket. Schematic element and footprint production proven. Spark Fun Electronics SKU : PRT-00127. tDoc lines correctly indicate media card edge positions when inserting (unlocked, locked, depressed). NOTE: CD1 and CD2 are connected internally; PROD_ID: CONN-07820
L1 = SparkFun-Coils:10μH_SHIELDED_INDUCTOR: Murata 10uH Inductor 10uH 60mA 400mOhm 0805 Package Shielded; PROD_ID: NDUC-13231
LOGO2 = SparkFun-Aesthetics:SFE_LOGO_NAME_FLAME: SparkFun Font Logo w/ Flame This is the SparkFun full logo. The logo on the schematic will always be the same size; the package variant is the height of the flame part of the logo. Default layer for the logo on the board is tSilk.
LOGO3 = SparkFun-Aesthetics:QWIIC_LOGO: Qwiic Logos for placement on schematic and PCB. The 5.5mm silk logo is best for placing next to Qwiic connector.
Q1 = SparkFun-DiscreteSemi:MOSFET_PCH: P-channel MOSFETs Voltage controlled devices that allow control of high current outputs. SparkFun Products: SparkFun ESP32 Thing <https://www.sparkfun.com/products/13907> SparkFun ESP8266 Thing <https://www.sparkfun.com/products/13231> SparkFun Pi Servo HAT V2 <https://www.sparkfun.com/products/15316> DMG2305UX-7 (20V/4.2A/SOT23-3); PROD_ID: TRANS-11308
R1 = SparkFun-Resistors:33OHM: 33Ω resistor A resistor is a passive two-terminal electrical component that implements electrical resistance as a circuit element. Resistors act to reduce current flow, and, at the same time, act to lower voltage levels within circuits. - Wikipedia; PROD_ID: RES-08270
R2 = SparkFun-Resistors:1MOHM: 1MΩ resistor A resistor is a passive two-terminal electrical component that implements electrical resistance as a circuit element. Resistors act to reduce current flow, and, at the same time, act to lower voltage levels within circuits. - Wikipedia; PROD_ID: RES-07868
R3 R4 R18 R23 = SparkFun-Resistors:10KOHM: 10kΩ resistor A resistor is a passive two-terminal electrical component that implements electrical resistance as a circuit element. Resistors act to reduce current flow, and, at the same time, act to lower voltage levels within circuits. - Wikipedia; PROD_ID: RES-14241
R5 = SparkFun-Resistors:560OHM; PROD_ID: RES-13766
R6 R9 R10 R19-R22 = SparkFun-Resistors:100KOHM: 100kΩ resistor A resistor is a passive two-terminal electrical component that implements electrical resistance as a circuit element. Resistors act to reduce current flow, and, at the same time, act to lower voltage levels within circuits. - Wikipedia; PROD_ID: RES-13495
R7 R8 = SparkFun-Resistors:390OHM: 390Ω resistor A resistor is a passive two-terminal electrical component that implements electrical resistance as a circuit element. Resistors act to reduce current flow, and, at the same time, act to lower voltage levels within circuits. - Wikipedia; PROD_ID: RES-07864
R11 R12 = SparkFun-Resistors:240OHM: 240Ω resistor A resistor is a passive two-terminal electrical component that implements electrical resistance as a circuit element. Resistors act to reduce current flow, and, at the same time, act to lower voltage levels within circuits. - Wikipedia; PROD_ID: RES-07849
R14 R15 R59-R64 = SparkFun-Resistors:33KOHM: 33kΩ resistor A resistor is a passive two-terminal electrical component that implements electrical resistance as a circuit element. Resistors act to reduce current flow, and, at the same time, act to lower voltage levels within circuits. - Wikipedia; PROD_ID: RES-15128
R16 = SparkFun-Resistors:2.2OHM: 2.2Ω resistor A resistor is a passive two-terminal electrical component that implements electrical resistance as a circuit element. Resistors act to reduce current flow, and, at the same time, act to lower voltage levels within circuits. - Wikipedia; PROD_ID: RES-07823
R17 = SparkFun-Resistors:5.62KOHM: 5.62kΩ resistor A resistor is a passive two-terminal electrical component that implements electrical resistance as a circuit element. Resistors act to reduce current flow, and, at the same time, act to lower voltage levels within circuits. - Wikipedia; PROD_ID: RES-09823
R25-R28 R37-R44 R56-R58 R65 = SparkFun-Resistors:10OHM: 10Ω resistor A resistor is a passive two-terminal electrical component that implements electrical resistance as a circuit element. Resistors act to reduce current flow, and, at the same time, act to lower voltage levels within circuits. - Wikipedia; PROD_ID: RES-16072
R45-R48 R55 = SparkFun-Resistors:220OHM: 220Ω resistor A resistor is a passive two-terminal electrical component that implements electrical resistance as a circuit element. Resistors act to reduce current flow, and, at the same time, act to lower voltage levels within circuits. - Wikipedia; PROD_ID: RES-07861
R49 R50 = SparkFun-Resistors:5.1KOHM; PROD_ID: RES-14340
R51 R52 = SparkFun-Resistors:2.2KOHM: 2.2kΩ resistor A resistor is a passive two-terminal electrical component that implements electrical resistance as a circuit element. Resistors act to reduce current flow, and, at the same time, act to lower voltage levels within circuits. - Wikipedia; PROD_ID: RES-14341
R53 R54 = SparkFun-Resistors:100OHM: 100Ω resistor A resistor is a passive two-terminal electrical component that implements electrical resistance as a circuit element. Resistors act to reduce current flow, and, at the same time, act to lower voltage levels within circuits. - Wikipedia; PROD_ID: RES-07863
S1 S3 = SparkFun-Switches:MOMENTARY-SWITCH-SPST: Momentary Switch (Pushbutton) - SPST Normally-open (NO) SPST momentary switches (buttons, pushbuttons). Variants PTH-12MM - 12mm square, through-hole Momentary Pushbutton Switch - 12mm Square (COM-09190) PTH-6.0MM, PTH-6.0MM-KIT - 6.0mm square, through-hole Mini Pushbutton Switch (COM-00097) KIT package intended for soldering kit's - only one side of pads' copper is exposed. PTH-RIGHT-ANGLE-KIT - Right-angle, through-hole Right Angle Tactile Button - Used on SparkFun BigTime Watch Kit SMD-12MM - 12mm square, surface-mount Tactile Button - SMD (12mm) (COM-12993) Used on SparkFun PicoBoard SMD-4.5MM - 4.5mm Square Trackball Switch Used on SparkFun Blackberry Trackballer Breakout SMD-4.6MMX2.8MM - 4.60mm x 2.80mm, surface mount Used on SparkFun Pro Micro - RP2040 SMD-5.2MM, SMD-5.2-REDUNDANT - 5.2mm square, surface-mount Mini Pushbutton Switch - SMD (COM-08720) Used on Arduino Pro Mini REDUNDANT package connects both switch circuits together SMD-6.0X3.5MM - 6.0 x 3.5mm, surface mount Momentary Reset Switch SMD (COM-08229) SMD-6.2MM-TALL - 6.2mm square, surface mount Tactile Button - SMD (6mm) Used on SparkFun Digital Sandbox SMD-RIGHT-ANGLE - Right-angle, surface mount Used on SparkFun Block for Intel® Edison - Arduino; PROD_ID: SWCH-14139
S2 S4 = SparkFun-Switches:MOMENTARY-SWITCH-SPST: Momentary Switch (Pushbutton) - SPST Normally-open (NO) SPST momentary switches (buttons, pushbuttons). Variants PTH-12MM - 12mm square, through-hole Momentary Pushbutton Switch - 12mm Square (COM-09190) PTH-6.0MM, PTH-6.0MM-KIT - 6.0mm square, through-hole Mini Pushbutton Switch (COM-00097) KIT package intended for soldering kit's - only one side of pads' copper is exposed. PTH-RIGHT-ANGLE-KIT - Right-angle, through-hole Right Angle Tactile Button - Used on SparkFun BigTime Watch Kit SMD-12MM - 12mm square, surface-mount Tactile Button - SMD (12mm) (COM-12993) Used on SparkFun PicoBoard SMD-4.5MM - 4.5mm Square Trackball Switch Used on SparkFun Blackberry Trackballer Breakout SMD-4.6MMX2.8MM - 4.60mm x 2.80mm, surface mount Used on SparkFun Pro Micro - RP2040 SMD-5.2MM, SMD-5.2-REDUNDANT - 5.2mm square, surface-mount Mini Pushbutton Switch - SMD (COM-08720) Used on Arduino Pro Mini REDUNDANT package connects both switch circuits together SMD-6.0X3.5MM - 6.0 x 3.5mm, surface mount Momentary Reset Switch SMD (COM-08229) SMD-6.2MM-TALL - 6.2mm square, surface mount Tactile Button - SMD (6mm) Used on SparkFun Digital Sandbox SMD-RIGHT-ANGLE - Right-angle, surface mount Used on SparkFun Block for Intel® Edison - Arduino; PROD_ID: CONN-10672; SF_SKU: COM-10791
TP1 TP2 TP4-TP9 = SparkFun-Connectors:TEST-POINT: SparkFun Test Points Bare copper test points for troubleshooting or In-Circuit-Testing. These are used by our Production team for verifying production board runs using pogo-pins on test beds. SparkFun Products: SparkFun LSM9DS1 Breakout <https://www.sparkfun.com/products/13284> SparkFun PSOC <https://www.sparkfun.com/products/13714> SparkFun Load Cell Amplifier <https://www.sparkfun.com/products/13879>
U1 U5 = SparkFun-IC-Power:V_REG_LM1117: Voltage Regulator LM1117 Standard adjustable voltage regulator but in SMD form. Spark Fun Electronics SKU : COM-00595; PROD_ID: VREG-08170
U3 = SparkFun-IC-Microcontroller:ATSAMS70NXXA-AN: Atmel SAMS70N20A-AN ARM-Based Microcontroller 32-bit ARM Cortex-M7 MCUs with FPU, Audio and Graphics Interfaces, High-Speed USB, Ethernet, and Advanced Analog Datasheet SparkFun Products SparkFun Tsunami Super WAV Trigger (WIG-13810); PROD_ID: IC-13238
U4 = SparkFun-IC-Amplifiers:LMV324: IC LMV324 Quad Op Amp Jellybean quad op-amp Datasheet SparkFun Products SparkFun Sensor Kit (DEV-13754) SparkFun Inventor's Kit for Arduino 101 (KIT-13844) SparkFun Sound Detector (SEN-12642); PROD_ID: IC-08227
U6 = SparkFun-DiscreteSemi:OPTO_DARL_6N138S: Optoisolator, darlington pair output Optocoupler consisting of an AlGaAs LED optically coupled to a high gain split darlington photodetector. SparkFun Products: SparkFun MIDI Shield <https://www.sparkfun.com/products/12898>; PROD_ID: IC-09482
U7 = tsunami:ADAU1328; PROD_ID: IC-16007
U8 = SparkFun-IC-Logic:74*1G125: Single buffer Buffers & Line Drivers Tri-State Single Bus SOT-23-5 Datasheet SparkFun Products SparkFun SAMD21 Mini Breakout (DEV-13664) SparkFun SAMD21 Dev Breakout (DEV-13672) SparkFun MIDI Shield (DEV-12898) SparkFun WiFi Shield - CC3000 (DEV-12071) SparkFun Tsunami Super WAV Trigger (Qwiic) (DEV-18159); PROD_ID: IC-16588
Y1 = SparkFun-Clocks:CRYSTAL-11.2896: SparkFun Products SparkFun Tsunami Super WAV Trigger (WIG-13810); DKPART: 887-2353-1-ND; MFR: txc; MFRPART: 7B-11.2896MAAE-T; PROD_ID: XTAL-13463